# Altium schematic sheet MFU 1.00.SchDoc
size A4
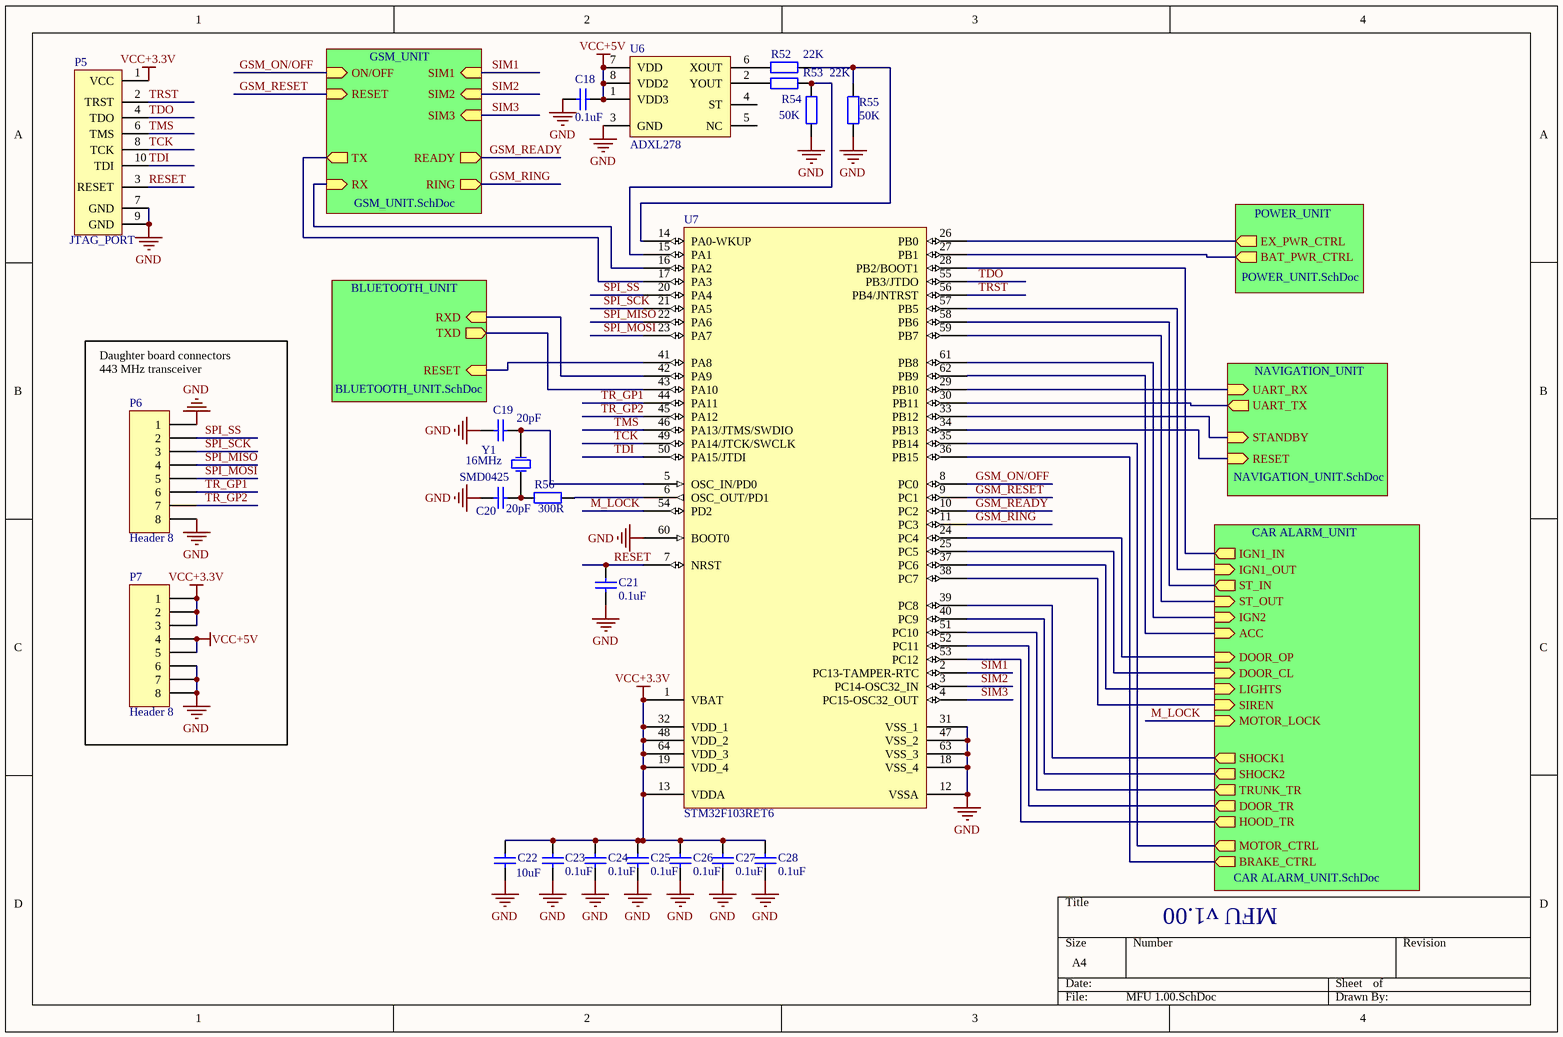
[diagram p0: MFU 1.00.SchDoc]

## Parts
C18  value 0.1uF  [C0603]  (hidden comment: 0805)
C19  value 20pF  [C0603]  (hidden comment: 0805)
C20  value 20pF  [C0603]  (hidden comment: 0805)
C21  value 0.1uF  [C0603]  (hidden comment: 0805)
C22  value 10uF  [C1210]  (hidden comment: Cap Semi)
C23  value 0.1uF  [C0603]  (hidden comment: 0805)
C24  value 0.1uF  [C0603]  (hidden comment: 0805)
C25  value 0.1uF  [C0603]  (hidden comment: 0805)
C26  value 0.1uF  [C0603]  (hidden comment: 0805)
C27  value 0.1uF  [C0603]  (hidden comment: 0805)
C28  value 0.1uF  [C0603]  (hidden comment: 0805)
P5  JTAG_PORT  [JTAG_connector]
P6  Header 8  [HDR1X8]
P7  Header 8  [HDR1X8]
R52  value 22K  [C0603]  (hidden comment: RES)
R53  value 22K  [C0603]  (hidden comment: RES)
R54  value 50K  [C0603]  (hidden comment: RES)
R55  value 50K  [C0603]  (hidden comment: RES)
R56  value 300R  [C0603]  (hidden comment: RES)
U6  ADXL278  [ADXL278]
U7  STM32F103RET6  [LQFP64_M]
Y1  SMD0425  value 16MHz  [QUARTZ_SMD0425]

## Sub-sheets
BLUETOOTH_UNIT = BLUETOOTH_UNIT.SchDoc: RXD (in), TXD (out), RESET (in)
CAR ALARM_UNIT = CAR ALARM_UNIT.SchDoc: IGN1_IN (out), ST_IN (out), ST_OUT (in), IGN1_OUT (in), IGN2 (in), ACC (in), DOOR_OP (in), DOOR_CL (in), MOTOR_LOCK (in), SIREN (in), LIGHTS (in), MOTOR_CTRL (out), HOOD_TR (out), SHOCK1 (out), SHOCK2 (out), TRUNK_TR (out), DOOR_TR (out), BRAKE_CTRL (out)
GSM_UNIT = GSM_UNIT.SchDoc: SIM1 (in), SIM2 (in), SIM3 (in), ON/OFF (in), RESET (in), READY (out), RING (out), TX (out), RX (in)
NAVIGATION_UNIT = NAVIGATION_UNIT.SchDoc: UART_RX (in), STANDBY (in), RESET (in), UART_TX (out)
POWER_UNIT = POWER_UNIT.SchDoc: EX_PWR_CTRL (out), BAT_PWR_CTRL (out)

## Nets
GND: C18.1 C19.2 C20.2 C21.1 C22.1 C23.1 C24.1 C25.1 C26.1 C27.1 C28.1 P5.7(GND) P5.9(GND) P6.1 P6.8 P7.6 P7.7 P7.8 R54.2 R55.2 U6.3(GND) U7.12(VSSA) U7.18(VSS_4) U7.31(VSS_1) U7.47(VSS_2) U7.60(BOOT0) U7.63(VSS_3)
VCC+3.3V: C22.2 C23.2 C24.2 C25.2 C26.2 C27.2 C28.2 P5.1(VCC) P7.1 P7.2 P7.3 U7.1(VBAT) U7.13(VDDA) U7.19(VDD_4) U7.32(VDD_1) U7.48(VDD_2) U7.64(VDD_3)
VCC+5V: C18.2 P7.4 P7.5 U6.1(VDD3) U6.7(VDD) U6.8(VDD2)
GSM_ON/OFF: U7.8(PC0) ; sheet GSM_UNIT/ON/OFF
GSM_READY: U7.10(PC2) ; sheet GSM_UNIT/READY
GSM_RESET: U7.9(PC1) ; sheet GSM_UNIT/RESET
GSM_RING: U7.11(PC3) ; sheet GSM_UNIT/RING
M_LOCK: U7.54(PD2) ; sheet CAR ALARM_UNIT/MOTOR_LOCK
RESET: C21.2 P5.3(RESET) U7.7(NRST)
SIM1: U7.2(PC13-TAMPER-RTC) ; sheet GSM_UNIT/SIM1
SIM2: U7.3(PC14-OSC32_IN) ; sheet GSM_UNIT/SIM2
SIM3: U7.4(PC15-OSC32_OUT) ; sheet GSM_UNIT/SIM3
SPI_MISO: P6.4 U7.22(PA6)
SPI_MOSI: P6.5 U7.23(PA7)
SPI_SCK: P6.3 U7.21(PA5)
SPI_SS: P6.2 U7.20(PA4)
TCK: P5.8(TCK) U7.49(PA14/JTCK/SWCLK)
TDI: P5.10(TDI) U7.50(PA15/JTDI)
TDO: P5.4(TDO) U7.55(PB3/JTDO)
TMS: P5.6(TMS) U7.46(PA13/JTMS/SWDIO)
TR_GP1: P6.6 U7.44(PA11)
TR_GP2: P6.7 U7.45(PA12)
TRST: P5.2(TRST) U7.56(PB4/JNTRST)
NetC19_1: C19.1 U7.5(OSC_IN/PD0) Y1.3(OSC2)
NetC20_1: C20.1 R56.1 Y1.1(OSC1)
NetR52_1: R52.1 R55.1 U7.14(PA0-WKUP)
NetR52_2: R52.2 U6.6(XOUT)
NetR53_1: R53.1 R54.1 U7.15(PA1)
NetR53_2: R53.2 U6.2(YOUT)
NetR56_2: R56.2 U7.6(OSC_OUT/PD1)
NetU7_16: U7.16(PA2) ; sheet GSM_UNIT/RX
NetU7_17: U7.17(PA3) ; sheet GSM_UNIT/TX
NetU7_24: U7.24(PC4) ; sheet CAR ALARM_UNIT/DOOR_OP
NetU7_25: U7.25(PC5) ; sheet CAR ALARM_UNIT/DOOR_CL
NetU7_26: U7.26(PB0) ; sheet POWER_UNIT/EX_PWR_CTRL
NetU7_27: U7.27(PB1) ; sheet POWER_UNIT/BAT_PWR_CTRL
NetU7_28: U7.28(PB2/BOOT1) ; sheet CAR ALARM_UNIT/IGN1_IN
NetU7_29: U7.29(PB10) ; sheet NAVIGATION_UNIT/UART_RX
NetU7_30: U7.30(PB11) ; sheet NAVIGATION_UNIT/UART_TX
NetU7_33: U7.33(PB12) ; sheet NAVIGATION_UNIT/STANDBY
NetU7_34: U7.34(PB13) ; sheet NAVIGATION_UNIT/RESET
NetU7_35: U7.35(PB14) ; sheet CAR ALARM_UNIT/MOTOR_CTRL
NetU7_36: U7.36(PB15) ; sheet CAR ALARM_UNIT/BRAKE_CTRL
NetU7_37: U7.37(PC6) ; sheet CAR ALARM_UNIT/LIGHTS
NetU7_38: U7.38(PC7) ; sheet CAR ALARM_UNIT/SIREN
NetU7_39: U7.39(PC8) ; sheet CAR ALARM_UNIT/SHOCK1
NetU7_40: U7.40(PC9) ; sheet CAR ALARM_UNIT/SHOCK2
NetU7_41: U7.41(PA8) ; sheet BLUETOOTH_UNIT/RESET
NetU7_42: U7.42(PA9) ; sheet BLUETOOTH_UNIT/RXD
NetU7_43: U7.43(PA10) ; sheet BLUETOOTH_UNIT/TXD
NetU7_51: U7.51(PC10) ; sheet CAR ALARM_UNIT/TRUNK_TR
NetU7_52: U7.52(PC11) ; sheet CAR ALARM_UNIT/DOOR_TR
NetU7_53: U7.53(PC12) ; sheet CAR ALARM_UNIT/HOOD_TR
NetU7_57: U7.57(PB5) ; sheet CAR ALARM_UNIT/IGN1_OUT
NetU7_58: U7.58(PB6) ; sheet CAR ALARM_UNIT/ST_IN
NetU7_59: U7.59(PB7) ; sheet CAR ALARM_UNIT/ST_OUT
NetU7_61: U7.61(PB8) ; sheet CAR ALARM_UNIT/IGN2
NetU7_62: U7.62(PB9) ; sheet CAR ALARM_UNIT/ACC

Not connected (* = marked no-connect by the designer): U6 4(ST) 5(NC)

## Notes on the sheet
- (near P6) Daughter board connectors
  443 MHz transceiver
- MFU v1.00

## Library data of the parts
C18-C21 C23-C28 = Capasitor_SMD_0805: Capasitor_SMD_0808/
C22 = Cap Semi: Capacitor (Semiconductor SIM Model); Published: 8-Jun-2000; LatestRevisionDate: 29-May-2009; LatestRevisionNote: IPC-7351 Footprint Added.; PackageReference: C1206; Publisher: Altium Limited; PackageDescription: Chip Capacitor
P6 P7 = Header 8: Header, 8-Pin; LatestRevisionDate: 17-Jul-2002; LatestRevisionNote: Re-released for DXP Platform.; Publisher: Altium Limited
R52-R56 = RES: Resistor
U7 = STM32F103RBT6: STM32 ARM-based 32-bit MCU with 512 Kbytes Flash, 64-pin LQFP, Industrial Temperature; Published: 30-May-2008; DatasheetVersion: rev6, Mar-2008; PackageVersion: Mar-2008; PackageReference: LQFP64; Publisher: Altium Limited; PackageDescription: 64-Pin Low-Profile Quad Flat Pack, 10 x 10 mm Body, 0.5 mm Pitch (LQFP64); ComponentLink1Description: Manufacturer Link; ComponentLink1URL: www.st.com/stm32; ComponentLink2Description: Datasheet; ComponentLink2URL: http://www.st.com/stonline/products/literature/ds/13587.pdf
Y1 = Quartz_SMD